# Altium project BackPlane4.PrjPCB
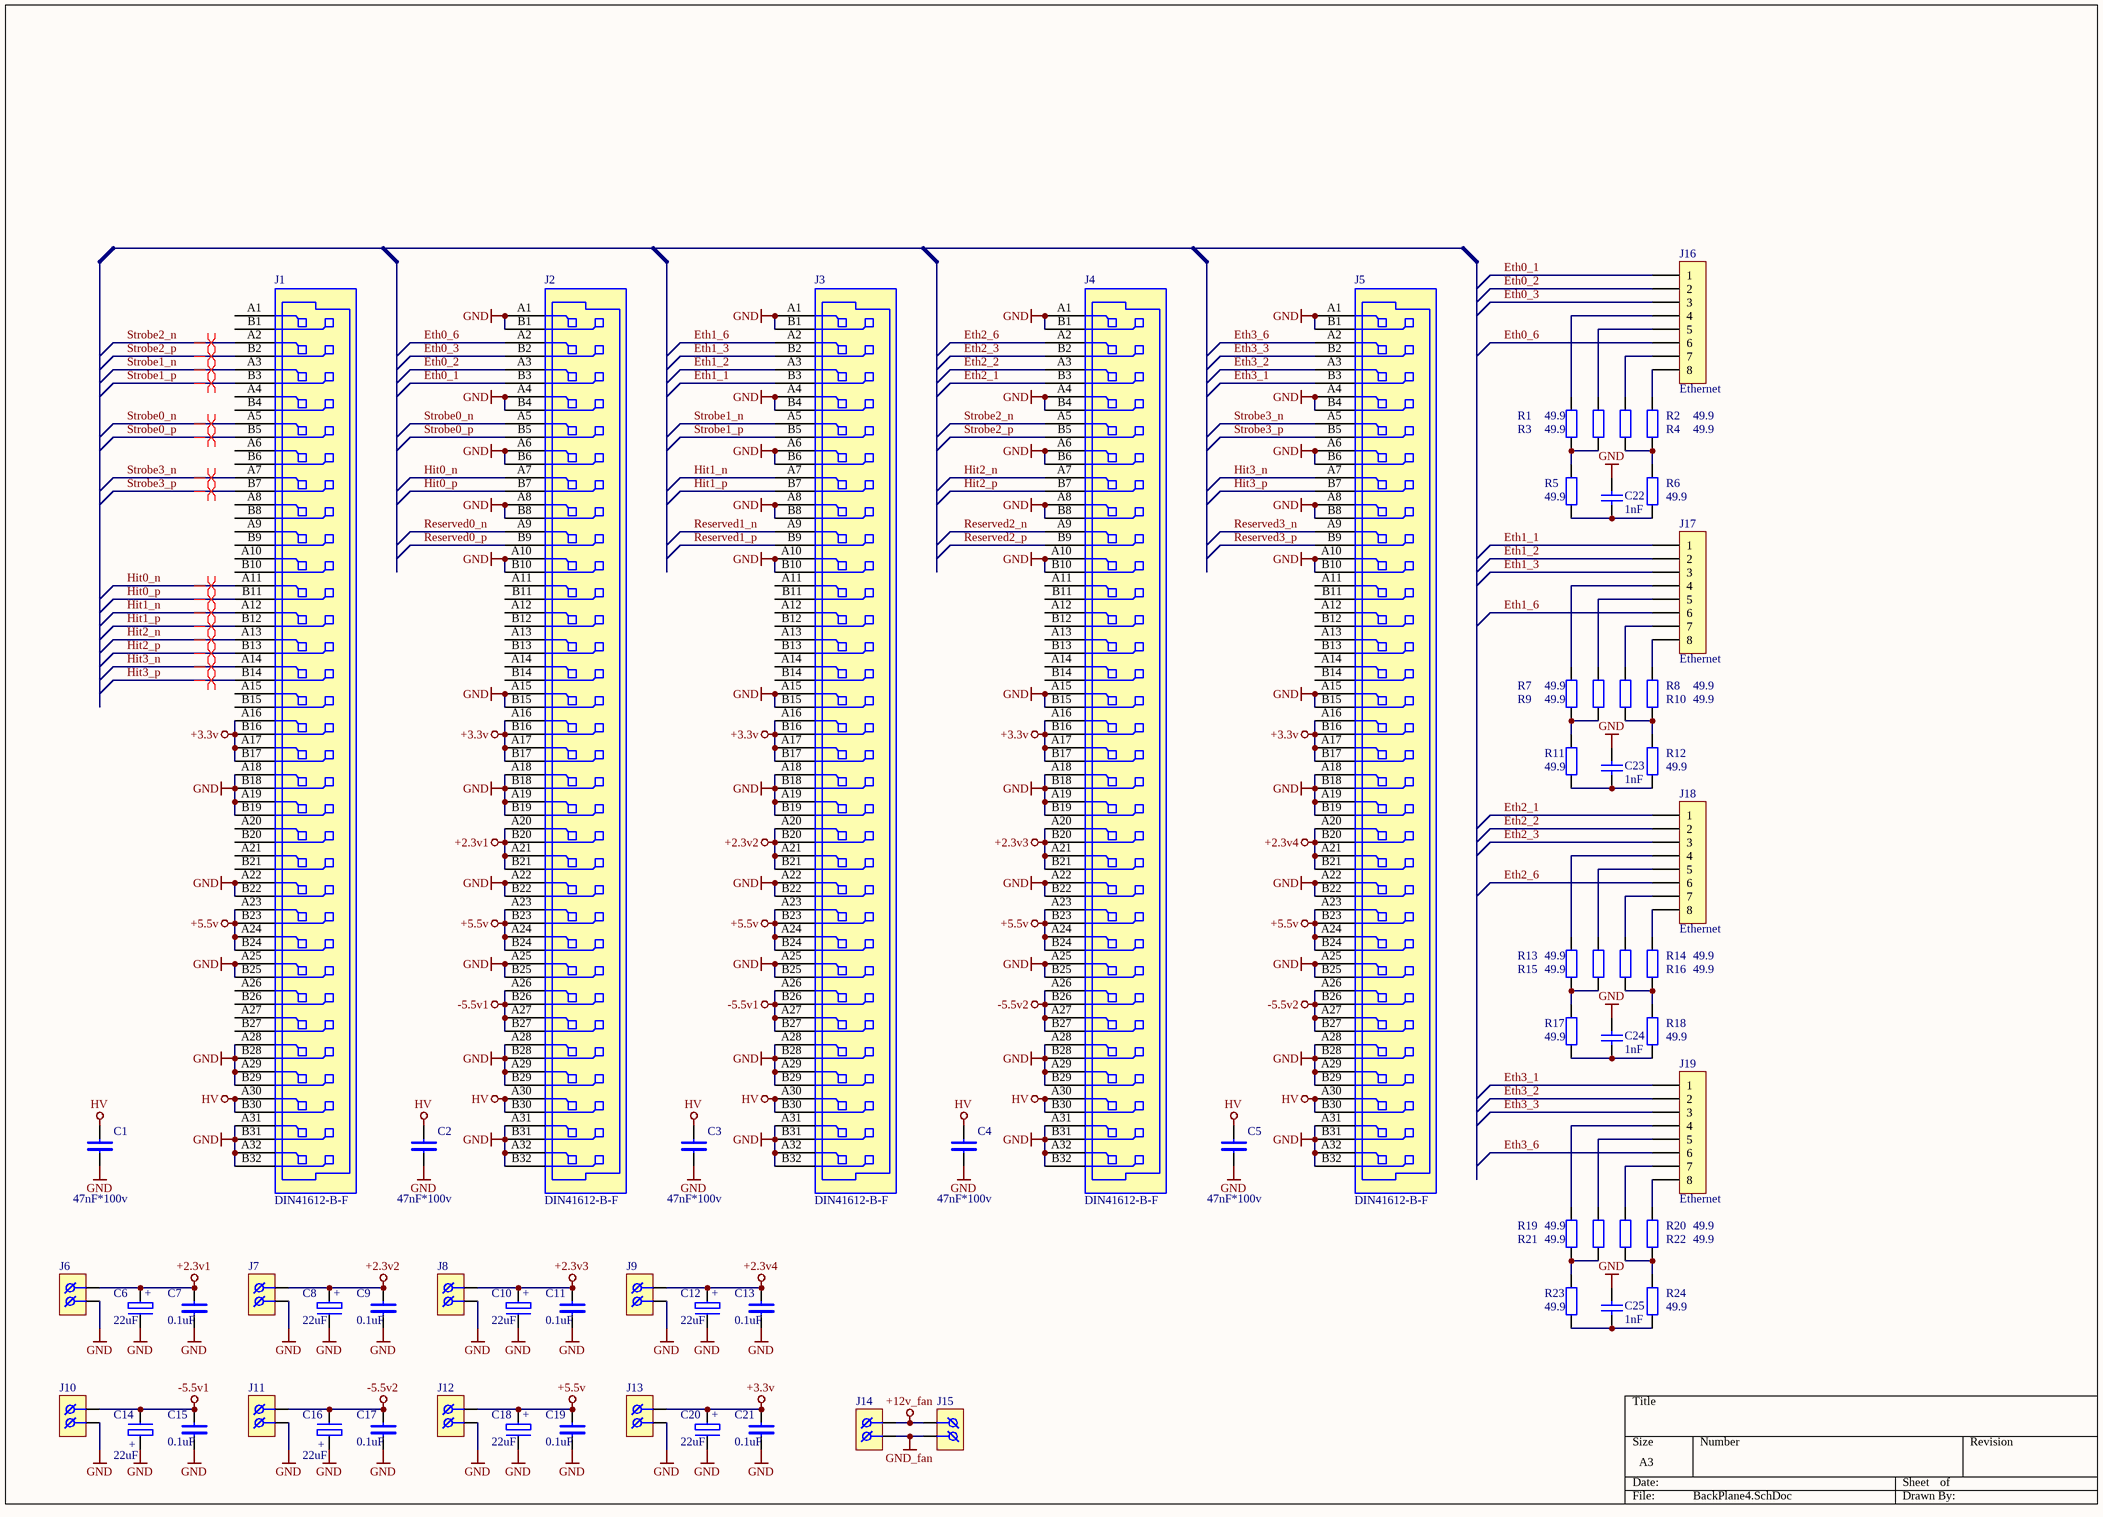
[diagram p0: BackPlane4.SchDoc]
1 sheet, 68 parts. Net scope: global (net labels, ports and power ports of the same name join across sheets).
Board file: BackPlane4.PcbDoc

## Sheet BackPlane4.SchDoc
size A3

### Parts
C1  47nF*100v  [1206]
C2  47nF*100v  [1206]
C3  47nF*100v  [1206]
C4  47nF*100v  [1206]
C5  47nF*100v  [1206]
C6  22uF  [CP6032]
C7  0.1uF  [1206]
C8  22uF  [CP6032]
C9  0.1uF  [1206]
C10  22uF  [CP6032]
C11  0.1uF  [1206]
C12  22uF  [CP6032]
C13  0.1uF  [1206]
C14  22uF  [CP6032]
C15  0.1uF  [1206]
C16  22uF  [CP6032]
C17  0.1uF  [1206]
C18  22uF  [CP6032]
C19  0.1uF  [1206]
C20  22uF  [CP6032]
C21  0.1uF  [1206]
C22  1nF  [0805]
C23  1nF  [0805]
C24  1nF  [0805]
C25  1nF  [0805]
J1  DIN41612-B-F  [DIN41612-B-F]
J2  DIN41612-B-F  [DIN41612-B-F]
J3  DIN41612-B-F  [DIN41612-B-F]
J4  DIN41612-B-F  [DIN41612-B-F]
J5  DIN41612-B-F  [DIN41612-B-F]
J6  DG300-5-02  [DG300-5-02]  (value not drawn)
J7  DG300-5-02  [DG300-5-02]  (value not drawn)
J8  DG300-5-02  [DG300-5-02]  (value not drawn)
J9  DG300-5-02  [DG300-5-02]  (value not drawn)
J10  DG300-5-02  [DG300-5-02]  (value not drawn)
J11  DG300-5-02  [DG300-5-02]  (value not drawn)
J12  DG300-5-02  [DG300-5-02]  (value not drawn)
J13  DG300-5-02  [DG300-5-02]  (value not drawn)
J14  DG300-5-02  [DG300-5-02]  (value not drawn)
J15  DG300-5-02  [DG300-5-02]  (value not drawn)
J16  Ethernet  [TJ2-8P8C]
J17  Ethernet  [TJ2-8P8C]
J18  Ethernet  [TJ2-8P8C]
J19  Ethernet  [TJ2-8P8C]
R1  49.9  [0805]
R2  49.9  [0805]
R3  49.9  [0805]
R4  49.9  [0805]
R5  49.9  [0805]
R6  49.9  [0805]
R7  49.9  [0805]
R8  49.9  [0805]
R9  49.9  [0805]
R10  49.9  [0805]
R11  49.9  [0805]
R12  49.9  [0805]
R13  49.9  [0805]
R14  49.9  [0805]
R15  49.9  [0805]
R16  49.9  [0805]
R17  49.9  [0805]
R18  49.9  [0805]
R19  49.9  [0805]
R20  49.9  [0805]
R21  49.9  [0805]
R22  49.9  [0805]
R23  49.9  [0805]
R24  49.9  [0805]

### Nets
+2.3v1: C6.+ C7.2 J2.A20 J2.A21 J2.B20 J2.B21 J6.1
+2.3v2: C8.+ C9.2 J3.A20 J3.A21 J3.B20 J3.B21 J7.1
+2.3v3: C10.+ C11.2 J4.A20 J4.A21 J4.B20 J4.B21 J8.1
+2.3v4: C12.+ C13.2 J5.A20 J5.A21 J5.B20 J5.B21 J9.1
+3.3v: C20.+ C21.2 J1.A16 J1.A17 J1.B16 J1.B17 J2.A16 J2.A17 J2.B16 J2.B17 J3.A16 J3.A17 J3.B16 J3.B17 J4.A16 J4.A17 J4.B16 J4.B17 J5.A16 J5.A17 J5.B16 J5.B17 J13.1
+5.5v: C18.+ C19.2 J1.A23 J1.A24 J1.B23 J1.B24 J2.A23 J2.A24 J2.B23 J2.B24 J3.A23 J3.A24 J3.B23 J3.B24 J4.A23 J4.A24 J4.B23 J4.B24 J5.A23 J5.A24 J5.B23 J5.B24 J12.1
+12v_fan: J14.1 J15.1
-5.5v1: C14.- C15.2 J2.A26 J2.A27 J2.B26 J2.B27 J3.A26 J3.A27 J3.B26 J3.B27 J10.1
-5.5v2: C16.- C17.2 J4.A26 J4.A27 J4.B26 J4.B27 J5.A26 J5.A27 J5.B26 J5.B27 J11.1
GND: C1.1 C2.1 C3.1 C4.1 C5.1 C6.- C7.1 C8.- C9.1 C10.- C11.1 C12.- C13.1 C14.+ C15.1 C16.+ C17.1 C18.- C19.1 C20.- C21.1 C22.1 C23.1 C24.1 C25.1 J1.A18 J1.A19 J1.A22 J1.A25 J1.A28 J1.A29 J1.A31 J1.A32 J1.B18 J1.B19 J1.B22 J1.B25 J1.B28 J1.B29 J1.B31 J1.B32 J2.A1 J2.A4 J2.A6 J2.A8 J2.A10 J2.A15 J2.A18 J2.A19 J2.A22 J2.A25 J2.A28 J2.A29 J2.A31 J2.A32 J2.B1 J2.B4 J2.B6 J2.B8 J2.B10 J2.B15 J2.B18 J2.B19 J2.B22 J2.B25 J2.B28 J2.B29 J2.B31 J2.B32 J3.A1 J3.A4 J3.A6 J3.A8 J3.A10 J3.A15 J3.A18 J3.A19 J3.A22 J3.A25 J3.A28 J3.A29 J3.A31 J3.A32 J3.B1 J3.B4 J3.B6 J3.B8 J3.B10 J3.B15 J3.B18 J3.B19 J3.B22 J3.B25 J3.B28 J3.B29 J3.B31 J3.B32 J4.A1 J4.A4 J4.A6 J4.A8 J4.A10 J4.A15 J4.A18 J4.A19 J4.A22 J4.A25 J4.A28 J4.A29 J4.A31 J4.A32 J4.B1 J4.B4 J4.B6 J4.B8 J4.B10 J4.B15 J4.B18 J4.B19 J4.B22 J4.B25 J4.B28 J4.B29 J4.B31 J4.B32 J5.A1 J5.A4 J5.A6 J5.A8 J5.A10 J5.A15 J5.A18 J5.A19 J5.A22 J5.A25 J5.A28 J5.A29 J5.A31 J5.A32 J5.B1 J5.B4 J5.B6 J5.B8 J5.B10 J5.B15 J5.B18 J5.B19 J5.B22 J5.B25 J5.B28 J5.B29 J5.B31 J5.B32 J6.2 J7.2 J8.2 J9.2 J10.2 J11.2 J12.2 J13.2
GND_fan: J14.2 J15.2
HV: C1.2 C2.2 C3.2 C4.2 C5.2 J1.A30 J1.B30 J2.A30 J2.B30 J3.A30 J3.B30 J4.A30 J4.B30 J5.A30 J5.B30
Eth0_1: J2.B3 J16.1
Eth0_2: J2.A3 J16.2
Eth0_3: J2.B2 J16.3
Eth0_6: J2.A2 J16.6
Eth1_1: J3.B3 J17.1
Eth1_2: J3.A3 J17.2
Eth1_3: J3.B2 J17.3
Eth1_6: J3.A2 J17.6
Eth2_1: J4.B3 J18.1
Eth2_2: J4.A3 J18.2
Eth2_3: J4.B2 J18.3
Eth2_6: J4.A2 J18.6
Eth3_1: J5.B3 J19.1
Eth3_2: J5.A3 J19.2
Eth3_3: J5.B2 J19.3
Eth3_6: J5.A2 J19.6
Hit0_n: J1.A11 J2.A7
Hit0_p: J1.B11 J2.B7
Hit1_n: J1.A12 J3.A7
Hit1_p: J1.B12 J3.B7
Hit2_n: J1.A13 J4.A7
Hit2_p: J1.B13 J4.B7
Hit3_n: J1.A14 J5.A7
Hit3_p: J1.B14 J5.B7
Reserved0_n: J2.A9
Reserved0_p: J2.B9
Reserved1_n: J3.A9
Reserved1_p: J3.B9
Reserved2_n: J4.A9
Reserved2_p: J4.B9
Reserved3_n: J5.A9
Reserved3_p: J5.B9
Strobe0_n: J1.A5 J2.A5
Strobe0_p: J1.B5 J2.B5
Strobe1_n: J1.A3 J3.A5
Strobe1_p: J1.B3 J3.B5
Strobe2_n: J1.A2 J4.A5
Strobe2_p: J1.B2 J4.B5
Strobe3_n: J1.A7 J5.A5
Strobe3_p: J1.B7 J5.B5
NetC22_2: C22.2 R5.2 R6.2
NetC23_2: C23.2 R11.2 R12.2
NetC24_2: C24.2 R17.2 R18.2
NetC25_2: C25.2 R23.2 R24.2
NetJ16_4: J16.4 R1.1
NetJ16_5: J16.5 R3.1
NetJ16_7: J16.7 R4.1
NetJ16_8: J16.8 R2.1
NetJ17_4: J17.4 R7.1
NetJ17_5: J17.5 R9.1
NetJ17_7: J17.7 R10.1
NetJ17_8: J17.8 R8.1
NetJ18_4: J18.4 R13.1
NetJ18_5: J18.5 R15.1
NetJ18_7: J18.7 R16.1
NetJ18_8: J18.8 R14.1
NetJ19_4: J19.4 R19.1
NetJ19_5: J19.5 R21.1
NetJ19_7: J19.7 R22.1
NetJ19_8: J19.8 R20.1
NetR1_2: R1.2 R3.2 R5.1
NetR2_2: R2.2 R4.2 R6.1
NetR7_2: R7.2 R9.2 R11.1
NetR8_2: R8.2 R10.2 R12.1
NetR13_2: R13.2 R15.2 R17.1
NetR14_2: R14.2 R16.2 R18.1
NetR19_2: R19.2 R21.2 R23.1
NetR20_2: R20.2 R22.2 R24.1

Not connected (* = marked no-connect by the designer): J1 A1 A4 A6 A8 A9 A10 A15 A20 A21 A26 A27 B1 B4 B6 B8 B9 B10 B15 B20 B21 B26 B27; J2 A11 A12 A13 A14 B11 B12 B13 B14; J3 A11 A12 A13 A14 B11 B12 B13 B14; J4 A11 A12 A13 A14 B11 B12 B13 B14; J5 A11 A12 A13 A14 B11 B12 B13 B14

### Layout directives
differential pair: Hit0_n, Hit0_p, Hit1_n, Hit1_p, Hit2_n, Hit2_p, Hit3_n, Hit3_p, Strobe0_n, Strobe0_p, Strobe1_n, Strobe1_p, Strobe2_n, Strobe2_p, Strobe3_n, Strobe3_p

### Library data of the parts
C1-C5 C7 C9 C11 C13 C15 C17 C19 C21 = C
C6 C8 C10 C12 C14 C16 C18 C20 = C POL
C22-C25 = Cap: Capacitor; Published: 8-Jun-2000; LatestRevisionDate: 17-Jul-2002; LatestRevisionNote: Re-released for DXP Platform.; Publisher: Altium Limited; Value: 1nF
J16-J19 = RJ-45: Connector
R1-R24 = Res2: Resistor; Published: 8-Jun-2000; LatestRevisionDate: 17-Jul-2002; LatestRevisionNote: Re-released for DXP Platform.; Publisher: Altium Limited; Value: 49.9; PackageReference: AXIAL-0.4